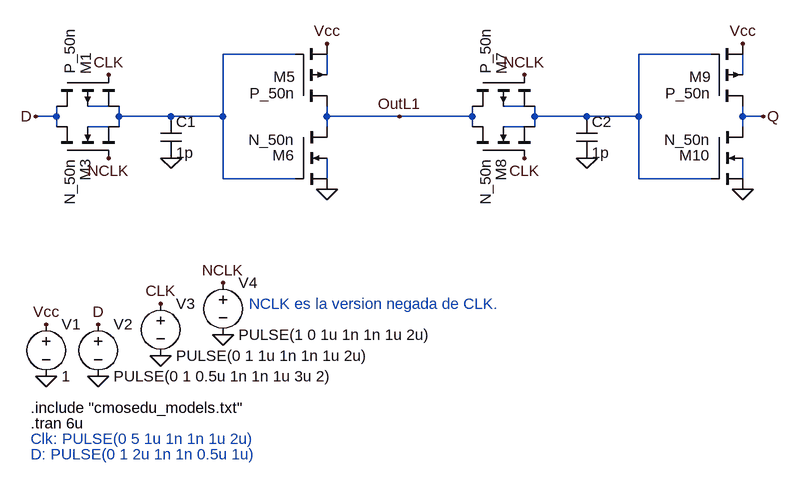
[diagram p0: schematic 2_ValidacionFuncionamiento.asc]
2_ValidacionFuncionamiento.asc, the LTspice schematic file:
Version 4
SHEET 1 2692 680
WIRE 1568 -256 1456 -256
WIRE 2208 -256 2096 -256
WIRE 1616 -224 1616 -256
WIRE 2256 -224 2256 -256
WIRE 1280 -176 1248 -176
WIRE 1920 -176 1888 -176
WIRE 1200 -160 1200 -176
WIRE 1200 -160 1168 -160
WIRE 1296 -160 1296 -176
WIRE 1376 -160 1296 -160
WIRE 1456 -160 1456 -256
WIRE 1456 -160 1376 -160
WIRE 1616 -160 1616 -176
WIRE 1728 -160 1616 -160
WIRE 1840 -160 1840 -176
WIRE 1840 -160 1728 -160
WIRE 1936 -160 1936 -176
WIRE 2016 -160 1936 -160
WIRE 2096 -160 2096 -256
WIRE 2096 -160 2016 -160
WIRE 2256 -160 2256 -176
WIRE 2288 -160 2256 -160
WIRE 1200 -144 1200 -160
WIRE 1280 -144 1248 -144
WIRE 1296 -144 1296 -160
WIRE 1616 -144 1616 -160
WIRE 1840 -144 1840 -160
WIRE 1920 -144 1888 -144
WIRE 1936 -144 1936 -160
WIRE 2256 -144 2256 -160
WIRE 1456 -64 1456 -160
WIRE 1568 -64 1456 -64
WIRE 1616 -64 1616 -96
WIRE 2096 -64 2096 -160
WIRE 2208 -64 2096 -64
WIRE 2256 -64 2256 -96
FLAG 1264 240 0
FLAG 1264 160 D
FLAG 1168 -160 D
FLAG 1360 208 0
FLAG 1360 128 CLK
FLAG 1456 176 0
FLAG 1456 96 NCLK
FLAG 1280 -224 CLK
FLAG 1280 -96 NCLK
FLAG 1184 240 0
FLAG 1184 160 Vcc
FLAG 1616 -48 0
FLAG 1616 -272 Vcc
FLAG 1920 -224 NCLK
FLAG 2256 -48 0
FLAG 2256 -272 Vcc
FLAG 1920 -96 CLK
FLAG 2288 -160 Q
FLAG 1376 -96 0
FLAG 2016 -96 0
FLAG 1728 -160 OutL1
SYMBOL pmos4 1200 -224 M90
WINDOW 0 0 45 Right 2
WINDOW 3 -1 20 Right 2
SYMATTR InstName M1
SYMATTR Value P_50n
SYMATTR Value2 l=50n w=1200n
SYMBOL nmos4 1200 -96 R270
WINDOW 0 -2 44 Right 2
WINDOW 3 -1 20 Right 2
SYMATTR InstName M3
SYMATTR Value N_50n
SYMATTR Value2 l=50n w=800n
SYMBOL voltage 1264 144 R0
WINDOW 123 0 0 Left 0
WINDOW 39 0 0 Left 0
SYMATTR InstName V2
SYMATTR Value PULSE(0 1 0.5u 1n 1n 1u 3u 2)
SYMBOL voltage 1360 112 R0
WINDOW 123 0 0 Left 0
WINDOW 39 0 0 Left 0
SYMATTR InstName V3
SYMATTR Value PULSE(0 1 1u 1n 1n 1u 2u)
SYMBOL voltage 1456 80 R0
WINDOW 123 0 0 Left 0
WINDOW 39 0 0 Left 0
SYMATTR InstName V4
SYMATTR Value PULSE(1 0 1u 1n 1n 1u 2u)
SYMBOL voltage 1184 144 R0
WINDOW 123 0 0 Left 0
WINDOW 39 0 0 Left 0
SYMATTR InstName V1
SYMATTR Value 1
SYMBOL pmos4 1568 -176 M180
WINDOW 0 0 45 Right 2
WINDOW 3 -1 20 Right 2
SYMATTR InstName M5
SYMATTR Value P_50n
SYMATTR Value2 l=50n w=1200n
SYMBOL nmos4 1568 -144 R0
WINDOW 0 -2 44 Right 2
WINDOW 3 -1 20 Right 2
SYMATTR InstName M6
SYMATTR Value N_50n
SYMATTR Value2 l=50n w=800n
SYMBOL pmos4 1840 -224 M90
WINDOW 0 0 45 Right 2
WINDOW 3 -1 20 Right 2
SYMATTR InstName M7
SYMATTR Value P_50n
SYMATTR Value2 l=50n w=1200n
SYMBOL nmos4 1840 -96 R270
WINDOW 0 -2 44 Right 2
WINDOW 3 -1 20 Right 2
SYMATTR InstName M8
SYMATTR Value N_50n
SYMATTR Value2 l=50n w=800n
SYMBOL pmos4 2208 -176 M180
WINDOW 0 0 45 Right 2
WINDOW 3 -1 20 Right 2
SYMATTR InstName M9
SYMATTR Value P_50n
SYMATTR Value2 l=50n w=1200n
SYMBOL nmos4 2208 -144 R0
WINDOW 0 -2 44 Right 2
WINDOW 3 -1 20 Right 2
SYMATTR InstName M10
SYMATTR Value N_50n
SYMATTR Value2 l=50n w=800n
SYMBOL cap 1360 -160 R0
SYMATTR InstName C1
SYMATTR Value 1p
SYMBOL cap 2000 -160 R0
SYMATTR InstName C2
SYMATTR Value 1p
TEXT 1160 288 Left 2 !.include "cmosedu_models.txt"
TEXT 1160 336 Left 2 ;Clk: PULSE(0 5 1u 1n 1n 1u 2u)
TEXT 1160 312 Left 2 !.tran 6u
TEXT 1160 360 Left 2 ;D: PULSE(0 1 2u 1n 1n 0.5u 1u)
TEXT 1496 128 Left 2 ;NCLK es la version negada de CLK.

The netlist it stands for:
* 2_ValidacionFuncionamiento.asc
M1 D CLK N001 N005 P_50n l=50n w=1200n
M3 D NCLK N001 N007 N_50n l=50n w=800n
V2 D 0 PULSE(0 1 0.5u 1n 1n 1u 3u 2)
V3 CLK 0 PULSE(0 1 1u 1n 1n 1u 2u)
V4 NCLK 0 PULSE(1 0 1u 1n 1n 1u 2u)
V1 Vcc 0 1
M5 OutL1 N001 Vcc N003 P_50n l=50n w=1200n
M6 OutL1 N001 0 N009 N_50n l=50n w=800n
M7 OutL1 NCLK N002 N006 P_50n l=50n w=1200n
M8 OutL1 CLK N002 N008 N_50n l=50n w=800n
M9 Q N002 Vcc N004 P_50n l=50n w=1200n
M10 Q N002 0 N010 N_50n l=50n w=800n
C1 N001 0 1p
C2 N002 0 1p
.model NMOS NMOS
.model PMOS PMOS
.lib standard.mos
.include "cmosedu_models.txt"
* Clk: PULSE(0 5 1u 1n 1n 1u 2u)
.tran 6u
* D: PULSE(0 1 2u 1n 1n 0.5u 1u)
* NCLK es la version negada de CLK.
.backanno
.end